# EAGLE schematic Tenor2G-014 (EAGLE 9.0.1)
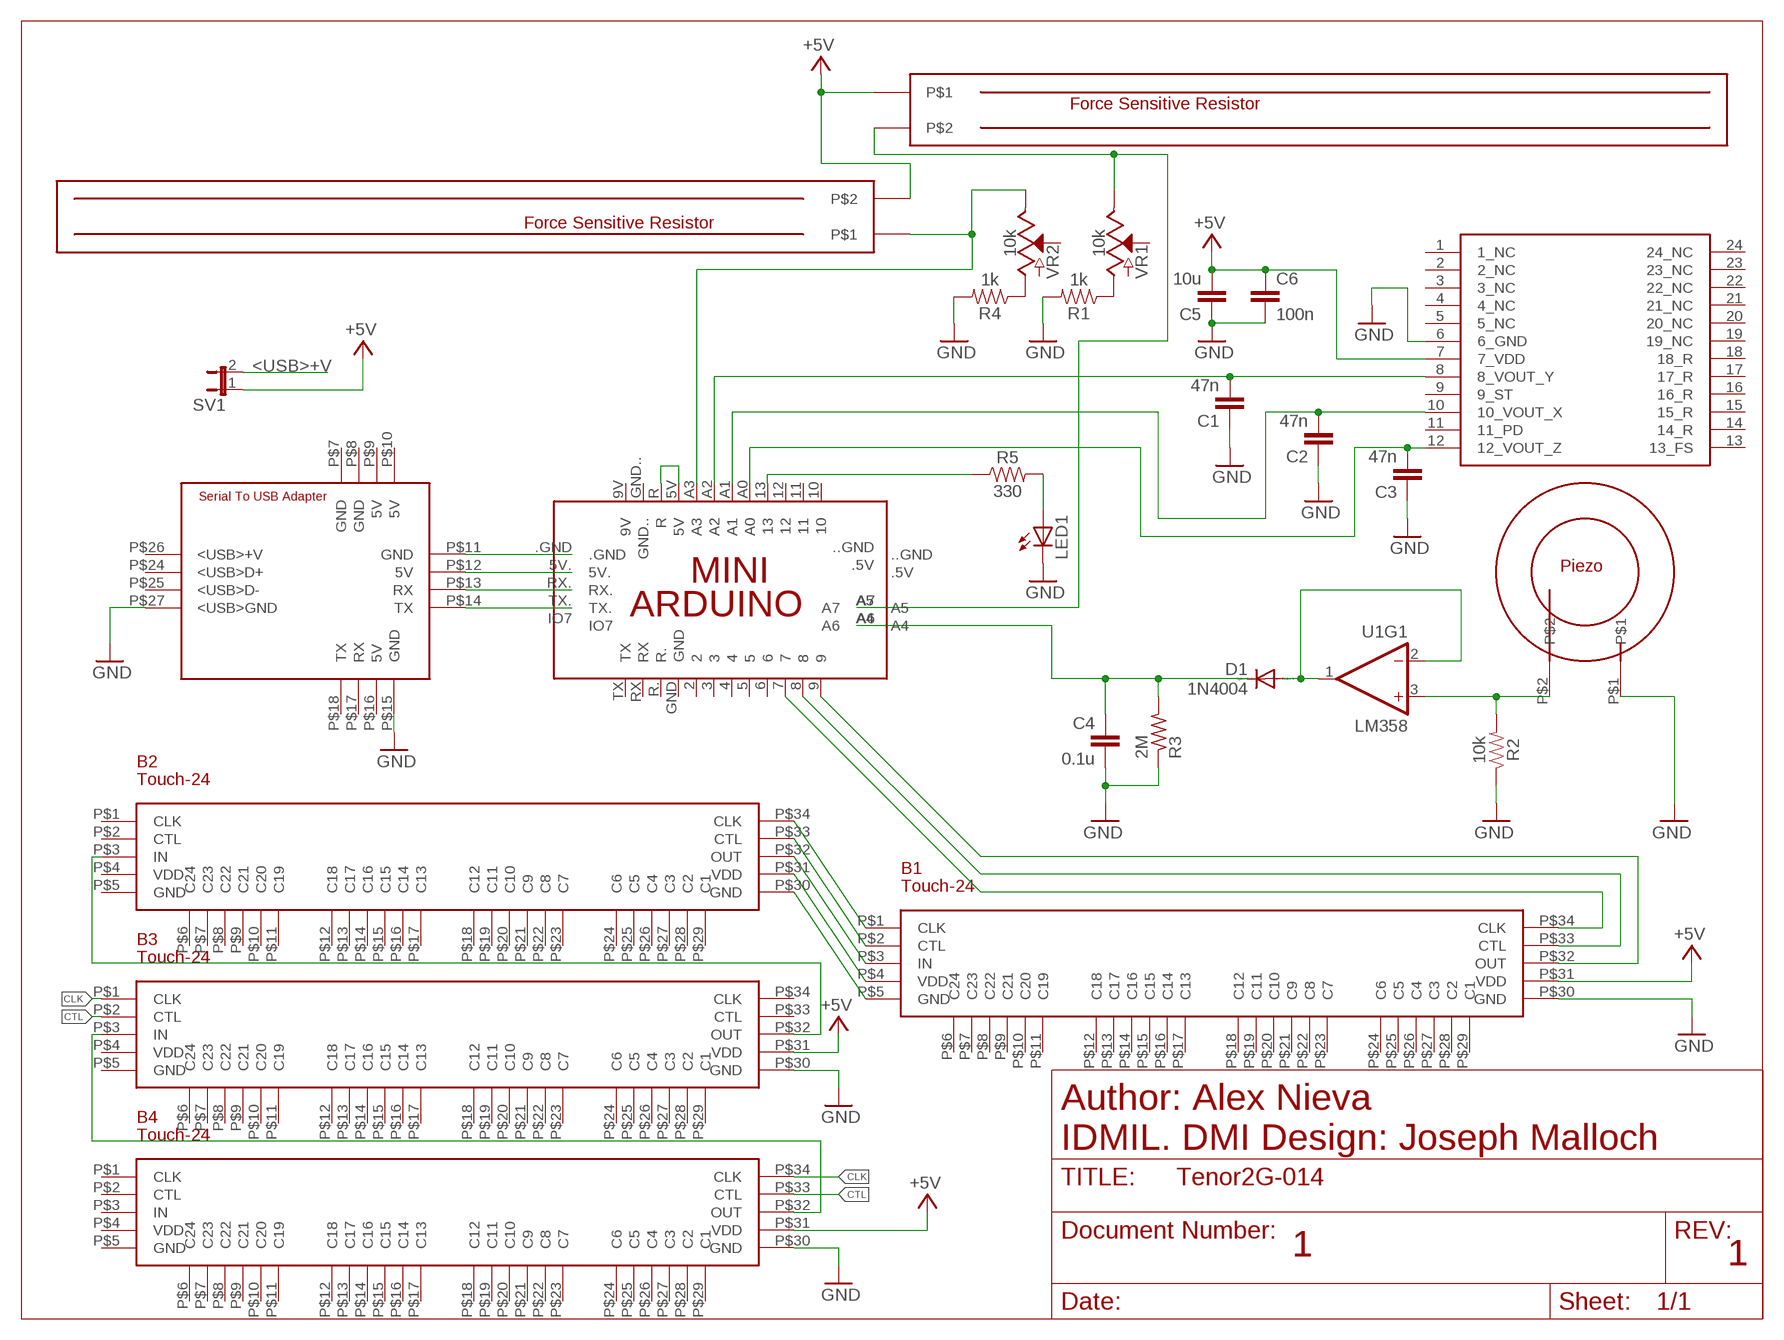
[diagram p0: schematic, sheet 1]

## Parts
B1  TOUCH-24TOUCH-24  [TOUCH24]
B2  TOUCH-24TOUCH-24  [TOUCH24]
B3  TOUCH-24TOUCH-24  [TOUCH24]
B4  TOUCH-24TOUCH-24  [TOUCH24]
C1  47n  C5/5.5  [C5B5.5]
C2  47n  C5/5.5  [C5B5.5]
C3  47n  C5/5.5  [C5B5.5]
C4  0.1u  C5/5.5  [C5B5.5]
C5  10u  C5/5.5  [C5B5.5]
C6  100n  C5/5.5  [C5B5.5]
D1  1N4004  [DO41-10]
LED1  LED3MM  [LED3MM]
PCB1  ARDUINO_MINI  [ARDUINO_MINI]
R1  1k  1KOHM-HORIZ-1/4W-1%  [AXIAL-0.3]
R2  10k  10KOHM-HORIZ-1/4W-1%  [AXIAL-0.3]
R3  2M  R-US_0204/7  [0204/7]
R4  1k  1KOHM-HORIZ-1/4W-1%  [AXIAL-0.3]
R5  330  1KOHM-HORIZ-1/4W-1%  [AXIAL-0.3]
SV1  JP1E  [JP1]
U1  LM358  [DIP08]
U$3  LIS3L02AS4  [SO-24]
U$4  SERIAL_TO_USB_ARDUINO_MINI  [SERIAL_TO_USB_ARDUINO]
U$5  FSR-TSTICK-SMALL  (no package)
U$6  PIEZO_TSTICK  [PIEZO_TSTICK]
U$7  FSR-TSTICK-SMALL  (no package)
VR1  10k  POTENTIOMETER-PTH-9MM-1/20W-20%  [POT-PTH-ALPS]
VR2  10k  POTENTIOMETER-PTH-9MM-1/20W-20%  [POT-PTH-ALPS]

## Nets
+5V [power]: B1.P$31(VDD) B3.P$31(VDD) B4.P$31(VDD) C5.2 C6.1 PCB1.5V. SV1.1 U$3.7(7_VDD) U$4.P$12(5V) U$5.P$1 U$7.P$2
<USB>+V [usbvcc]: SV1.2
CLK: B3.P$1(CLK) B4.P$34(CLK)
CTL: B3.P$2(CTL) B4.P$33(CTL)
GND: B1.P$30(GND) B3.P$30(GND) B4.P$30(GND) C1.1 C2.1 C3.1 C4.2 C5.1 C6.2 LED1.K(C) R1.P$2 R2.P$1 R3.1 R4.P$2 U$3.6(6_GND) U$4.P$15(GND) U$4.P$27(<USB>GND) U$6.P$1
N$1: B1.P$1(CLK) B2.P$34(CLK)
N$2: B1.P$2(CTL) B2.P$33(CTL)
N$3: B1.P$3(IN) B2.P$32(OUT)
N$4: B1.P$4(VDD) B2.P$31(VDD)
N$5: B1.P$5(GND) B2.P$30(GND)
N$6: PCB1..GND U$4.P$11(GND)
N$7: C3.2 PCB1.A0 U$3.12(12_VOUT_Z)
N$8: PCB1.RX. U$4.P$13(RX)
N$9: PCB1.TX. U$4.P$14(TX)
N$10: R4.P$1 VR2.P$3(A)
N$11: PCB1.A7 U$5.P$2 VR1.P$1(E)
N$12: R1.P$1 VR1.P$3(A)
N$13: B2.P$3(IN) B3.P$32(OUT)
N$14: D1.A U1.1(OUT) U1.2(-IN)
N$15: C4.1 D1.C PCB1.A6 R3.2
N$16: R2.P$2 U1.3(+IN) U$6.P$2
N$17: B1.P$34(CLK) PCB1.7
N$18: PCB1.5V PCB1.R
N$19: B1.P$33(CTL) PCB1.8
N$20: B1.P$32(OUT) PCB1.9
N$21: PCB1.A3 U$7.P$1 VR2.P$1(E)
N$22: C1.2 PCB1.A2 U$3.8(8_VOUT_Y)
N$23: C2.2 PCB1.A1 U$3.10(10_VOUT_X)
N$24: B3.P$3(IN) B4.P$32(OUT)
N$25: LED1.A R5.P$2
N$26: PCB1.13 R5.P$1
Unconnected: B1.P$6(C24) B1.P$7(C23) B1.P$8(C22) B1.P$9(C21) B1.P$10(C20) B1.P$11(C19) B1.P$12(C18) B1.P$13(C17) B1.P$14(C16) B1.P$15(C15) B1.P$16(C14) B1.P$17(C13) B1.P$18(C12) B1.P$19(C11) B1.P$20(C10) B1.P$21(C9) B1.P$22(C8) B1.P$23(C7) B1.P$24(C6) B1.P$25(C5) B1.P$26(C4) B1.P$27(C3) B1.P$28(C2) B1.P$29(C1) B2.P$1(CLK) B2.P$2(CTL) B2.P$4(VDD) B2.P$5(GND) B2.P$6(C24) B2.P$7(C23) B2.P$8(C22) B2.P$9(C21) B2.P$10(C20) B2.P$11(C19) B2.P$12(C18) B2.P$13(C17) B2.P$14(C16) B2.P$15(C15) B2.P$16(C14) B2.P$17(C13) B2.P$18(C12) B2.P$19(C11) B2.P$20(C10) B2.P$21(C9) B2.P$22(C8) B2.P$23(C7) B2.P$24(C6) B2.P$25(C5) B2.P$26(C4) B2.P$27(C3) B2.P$28(C2) B2.P$29(C1) B3.P$4(VDD) B3.P$5(GND) B3.P$6(C24) B3.P$7(C23) B3.P$8(C22) B3.P$9(C21) B3.P$10(C20) B3.P$11(C19) B3.P$12(C18) B3.P$13(C17) B3.P$14(C16) B3.P$15(C15) B3.P$16(C14) B3.P$17(C13) B3.P$18(C12) B3.P$19(C11) B3.P$20(C10) B3.P$21(C9) B3.P$22(C8) B3.P$23(C7) B3.P$24(C6) B3.P$25(C5) B3.P$26(C4) B3.P$27(C3) B3.P$28(C2) B3.P$29(C1) B3.P$33(CTL) B3.P$34(CLK) B4.P$1(CLK) B4.P$2(CTL) B4.P$3(IN) B4.P$4(VDD) B4.P$5(GND) B4.P$6(C24) B4.P$7(C23) B4.P$8(C22) B4.P$9(C21) B4.P$10(C20) B4.P$11(C19) B4.P$12(C18) B4.P$13(C17) B4.P$14(C16) B4.P$15(C15) B4.P$16(C14) B4.P$17(C13) B4.P$18(C12) B4.P$19(C11) B4.P$20(C10) B4.P$21(C9) B4.P$22(C8) B4.P$23(C7) B4.P$24(C6) B4.P$25(C5) B4.P$26(C4) B4.P$27(C3) B4.P$28(C2) B4.P$29(C1) PCB1.2 PCB1.3 PCB1.4 PCB1.5 PCB1.6 PCB1.9V PCB1.10 PCB1.11 PCB1.12 PCB1..5V PCB1...GND PCB1.A4 PCB1.A5 PCB1.GND PCB1.GND.. PCB1.IO7 PCB1.R. PCB1.RX PCB1.TX U1.4(P$V-) U1.5(+IN) U1.6(-IN) U1.7(OUT) U1.8(P$V+) U$3.1(1_NC) U$3.2(2_NC) U$3.3(3_NC) U$3.4(4_NC) U$3.5(5_NC) U$3.9(9_ST) U$3.11(11_PD) U$3.13(13_FS) U$3.14(14_R) U$3.15(15_R) U$3.16(16_R) U$3.17(17_R) U$3.18(18_R) U$3.19(19_NC) U$3.20(20_NC) U$3.21(21_NC) U$3.22(22_NC) U$3.23(23_NC) U$3.24(24_NC) U$4.P$7(GND) U$4.P$8(GND) U$4.P$9(5V) U$4.P$10(5V) U$4.P$16(5V) U$4.P$17(RX) U$4.P$18(TX) U$4.P$24(<USB>D+) U$4.P$25(<USB>D-) U$4.P$26(<USB>+V) VR1.P$2(S) VR2.P$2(S)

## Notes on the sheet
- Author: Alex Nieva
  IDMIL. DMI Design: Joseph Malloch
- 1 | 1

## Library data of the parts
B1-B4 = T-Stick:TOUCH-24
C1-C6 = capacitor-wima:C: CAPACITOR naming: grid - package width
D1 = diode:1N4004: DIODE general purpose rectifier, 1 A
LED1 = led:LED: LED OSRAM: - CHIPLED LG R971, LG N971, LY N971, LG Q971, LY Q971, LO R971, LY R971 LH N974, LH R974 LS Q976, LO Q976, LY Q976 LO Q996 - Hyper CHIPLED LW Q18S LB Q993, LB Q99A, LB R99A - SideLED LS A670, LO A670, LY A670, LG A670, LP A670 LB A673, LV A673, LT A673, LW A673 LH A674 LY A675 LS A676, LA A676, LO A676, LY A676, LW A676 LS A679, LY A679, LG A679 - Hyper Micro SIDELED® LS Y876, LA Y876, LO Y876, LY Y876 LT Y87S - SmartLED LW L88C, LW L88S LB L89C, LB L89S, LG L890 LS L89K, LO L89K, LY L89K LS L896, LA L896, LO L896, LY L896 - TOPLED LS T670, LO T670, LY T670, LG T670, LP T670 LSG T670, LSP T670, LSY T670, LOP T670, LYG T670 LG T671, LOG T671, LSG T671 LB T673, LV T673, LT T673, LW T673 LH T674 LS T676, LA T676, LO T676, LY T676, LB T676, LH T676, LSB T676, LW T676 LB T67C, LV T67C, LT T67C, LS T67K, LO T67K, LY T67K, LW E67C LS E67B, LA E67B, LO E67B, LY E67B, LB E67C, LV E67C, LT E67C LW T67C LS T679, LY T679, LG T679 LS T770, LO T770, LY T770, LG T770, LP T770 LB T773, LV T773, LT T773, LW T773 LH T774 LS E675, LA E675, LY E675, LS T675 LS T776, LA T776, LO T776, LY T776, LB T776 LHGB T686 LT T68C, LB T68C - Hyper Mini TOPLED® LB M676 - Mini TOPLED Santana® LG M470 LS M47K, LO M47K, LY M47K Source: http://www.osram.convergy.de LUXEON: - LUMILED® LXK2-PW12-R00, LXK2-PW12-S00, LXK2-PW14-U00, LXK2-PW14-V00 LXK2-PM12-R00, LXK2-PM12-S00, LXK2-PM14-U00 LXK2-PE12-Q00, LXK2-PE12-R00, LXK2-PE12-S00, LXK2-PE14-T00, LXK2-PE14-U00 LXK2-PB12-K00, LXK2-PB12-L00, LXK2-PB12-M00, LXK2-PB14-N00, LXK2-PB14-P00, LXK2-PB14-Q00 LXK2-PR12-L00, LXK2-PR12-M00, LXK2-PR14-Q00, LXK2-PR14-R00 LXK2-PD12-Q00, LXK2-PD12-R00, LXK2-PD12-S00 LXK2-PH12-R00, LXK2-PH12-S00 LXK2-PL12-P00, LXK2-PL12-Q00, LXK2-PL12-R00 Source: www.luxeon.com KINGBRIGHT: KA-3528ASYC Source: www.kingbright.com
PCB1 = E14_Arduino_revC:ARDUINO_MINI: Device for representing an Arduino Mini board with a footprint in an EAGLE design. Created by Dave Young for Element14. More EAGLE documentation at: http://www.element14.com/community/community/knode/cadsoft_eagle
R1 R4 = SparkFun-Resistors:1KOHM: 1kΩ resistor A resistor is a passive two-terminal electrical component that implements electrical resistance as a circuit element. Resistors act to reduce current flow, and, at the same time, act to lower voltage levels within circuits. - Wikipedia; PROD_ID: RES-12182
R2 = SparkFun-Resistors:10KOHM: 10kΩ resistor A resistor is a passive two-terminal electrical component that implements electrical resistance as a circuit element. Resistors act to reduce current flow, and, at the same time, act to lower voltage levels within circuits. - Wikipedia; PROD_ID: RES-12183
R3 = resistor:R-US_: RESISTOR, American symbol
R5 = SparkFun-Resistors:1KOHM: 1kΩ resistor A resistor is a passive two-terminal electrical component that implements electrical resistance as a circuit element. Resistors act to reduce current flow, and, at the same time, act to lower voltage levels within circuits. - Wikipedia; PROD_ID: RES-12182; VALUE: 1k
SV1 = jumper:JP1E: JUMPER
U1 = SparkFun-IC-Amplifiers:LM358: LM358 Jellybean op-amp Datasheet <http://www.sparkfun.com/datasheets/Components/General/LM358.pdf> SparkFun Products Op-Amp (Thru-Hole) - LM358 <https://www.sparkfun.com/products/9456> (COM-09456); PROD_ID: IC-09172
U$3 = lis3l02as4:LIS3L02AS4: www.st.com 3-axis-accelerometer
U$4 = T-Stick:SERIAL_TO_USB_ARDUINO_MINI: Serial to USB adapter for the Arduino mini 04 used in T-Sticks
U$5 U$7 = T-Stick:FSR-TSTICK-SMALL
U$6 = T-Stick:PIEZO_TSTICK
VR1 VR2 = SparkFun-Resistors:POTENTIOMETER: Potentiometer (Pot) Three-terminal potentiometers, with an adjustable wiper and two adjustable resistors. A pot can be used to create a configurable voltage divider, or as a variable resistor. Variants ALPS_POT and ALPS_POT_KIT - PTH, breadboard compatible, 9mm square pots Rotary Potentiometer - Linear (10k ohm) <https://www.sparkfun.com/products/9288> (COM-09288) The KIT variant exposes copper on only one side of the PTH pad, so the part can only be assembled on one side of the PCB. Useful for beginner soldering kits.; PROD_ID: RES-09177; SF_SKU: COM-09288

## Net classes
1 power: width 0.61 mm, clearance 0.254 mm
3 usbvcc: width 0.356 mm, clearance 0.254 mm